# EAGLE schematic Teensy LC meter (EAGLE 8.0.1)
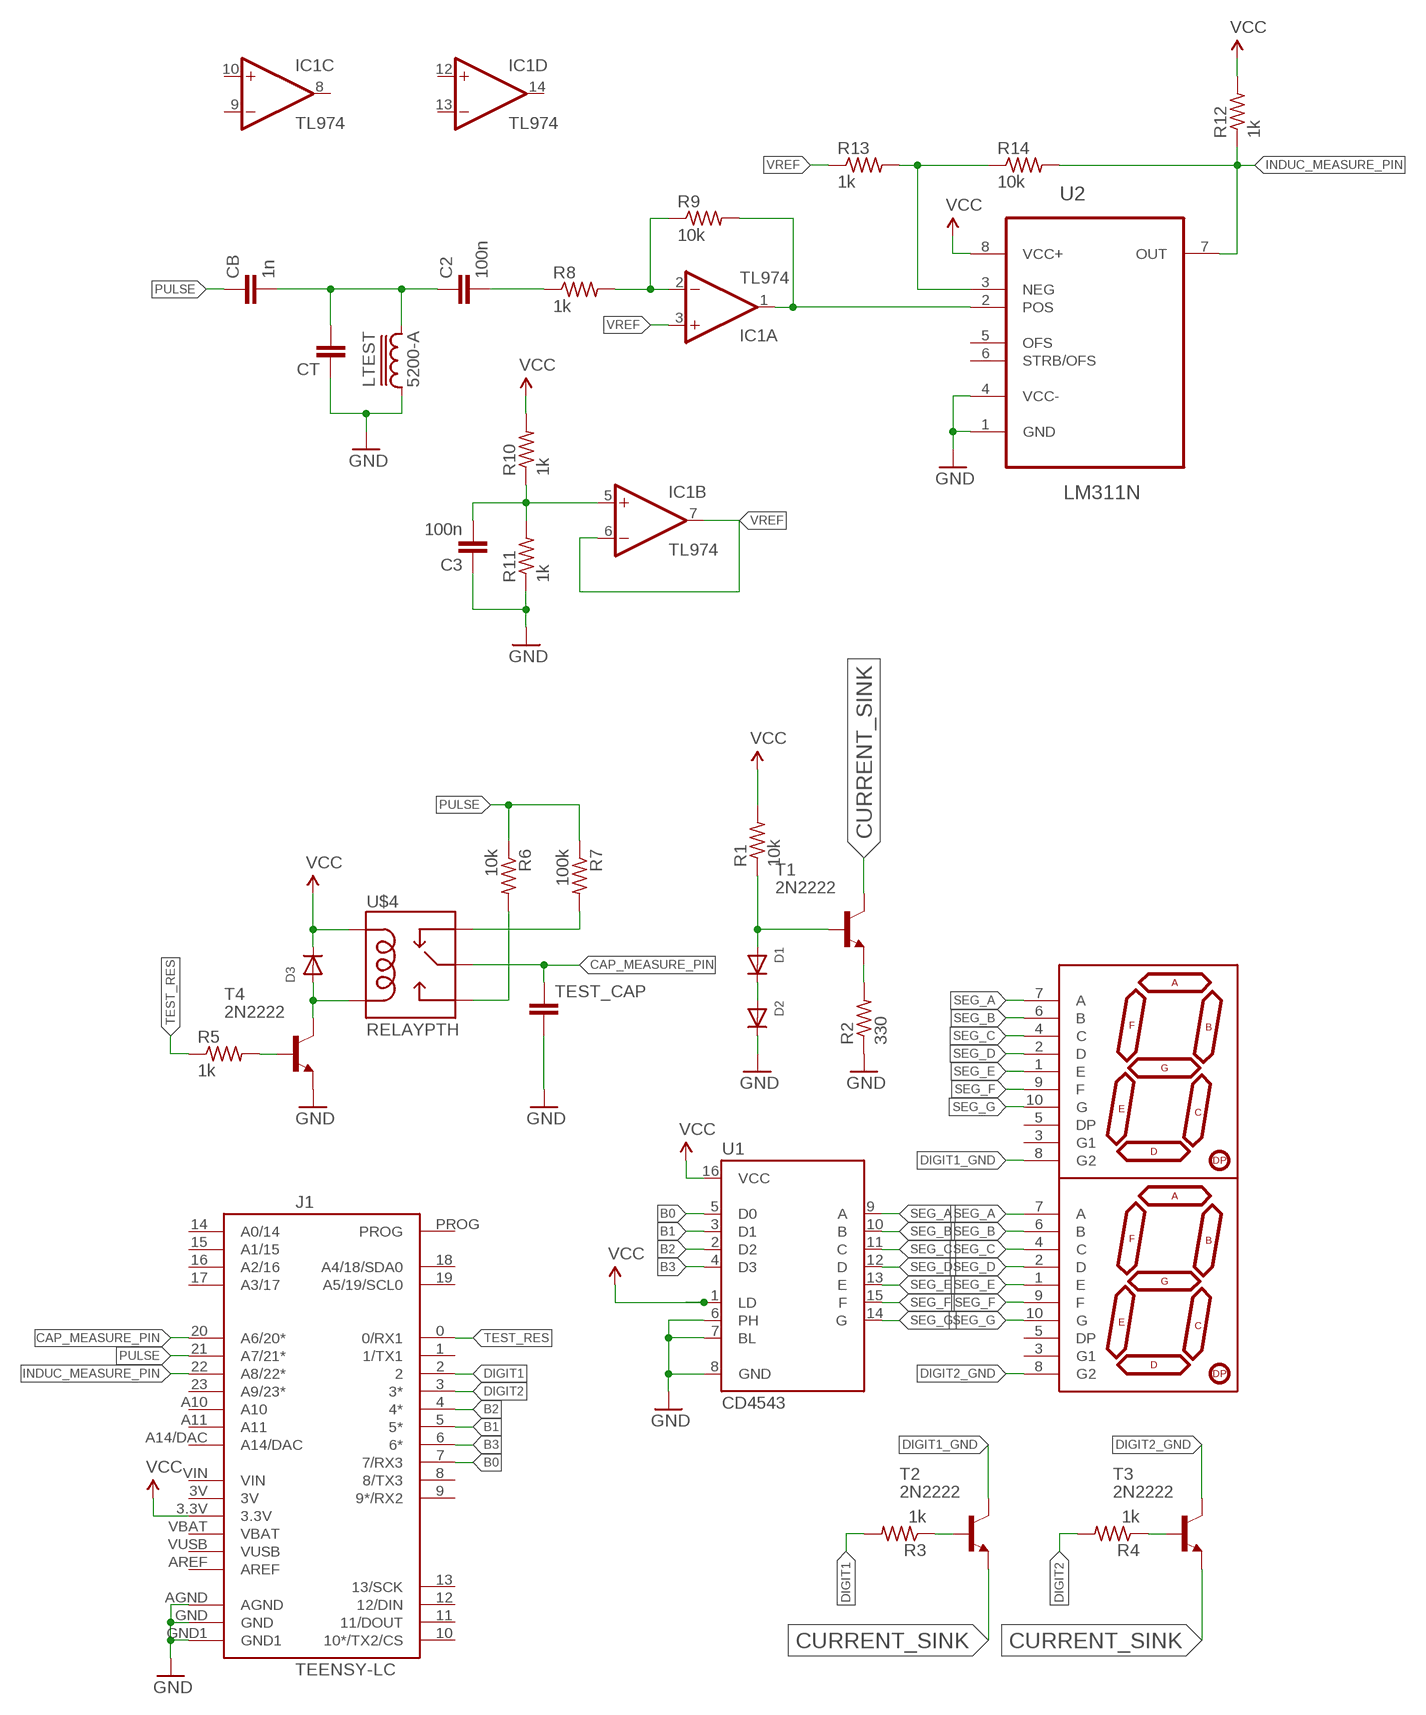
[diagram p0: schematic, sheet 1]

## Parts
C2  100n  CAPPTH  [CAP-PTH-SMALL]
C3  100n  CAPPTH  [CAP-PTH-SMALL]
CB  1n  CAPPTH  [CAP-PTH-SMALL]
CT  CAPPTH  [CAP-PTH-SMALL]
D1  DIODEDO-1N4148  [DO-1N4148]
D2  DIODEDO-1N4148  [DO-1N4148]
D3  DIODEDO-1N4148  [DO-1N4148]
IC1  TL974  QUAD_OPAMPD  [SO14]
J1  TEENSY-LC  TEENSY-3.1NOSILK  [TEENSY-3.1_NOSILK]
LTEST  5200-A  [5200-A]
R1  10k  FLIPFLOP-RES  [0805-THM]
R2  330  FLIPFLOP-RES  [0805-THM]
R3  1k  FLIPFLOP-RES  [0805-THM]
R4  1k  FLIPFLOP-RES  [0805-THM]
R5  1k  FLIPFLOP-RES  [0805-THM]
R6  10k  FLIPFLOP-RES  [0805-THM]
R7  100k  FLIPFLOP-RES  [0805-THM]
R8  1k  FLIPFLOP-RES  [0805-THM]
R9  10k  FLIPFLOP-RES  [0805-THM]
R10  1k  FLIPFLOP-RES  [0805-THM]
R11  1k  FLIPFLOP-RES  [0805-THM]
R12  1k  FLIPFLOP-RES  [0805-THM]
R13  1k  FLIPFLOP-RES  [0805-THM]
R14  10k  FLIPFLOP-RES  [0805-THM]
T1  2N2222  [TO92-EBC-OVAL]
T2  2N2222  [TO92-EBC-OVAL]
T3  2N2222  [TO92-EBC-OVAL]
T4  2N2222  [TO92-EBC-OVAL]
TEST_CAP  CAPPTH  [CAP-PTH-SMALL]
U1  CD4543  HEF4543PTH  [DIL16]
U2  LM311N  [DIP254P762X480-8]
U$2  7-SEGMENT-DISPLAY-1"-REDEZ  [7-SEGMENT-1"PTH-EZ]
U$3  7-SEGMENT-DISPLAY-1"-REDEZ  [7-SEGMENT-1"PTH-EZ]
U$4  RELAYPTH  [RELAY-G5Q]

## Nets
B0: J1.7(7/RX3) U1.5(D0)
B1: J1.5(5*) U1.3(D1)
B2: J1.4(4*) U1.2(D2)
B3: J1.6(6*) U1.4(D3)
CAP_MEASURE_PIN: J1.20(A6/20*) TEST_CAP.1 U$4.2(MAIN)
CURRENT_SINK: T1.C T2.E T3.E
DIGIT1: J1.2 R3.2
DIGIT1_GND: T2.C U$2.8(G2)
DIGIT2: J1.3(3*) R4.2
DIGIT2_GND: T3.C U$3.8(G2)
GND: C3.1 CT.1 D2.C J1.AGND J1.GND J1.GND1 LTEST.1 R2.1 R11.1 T4.E TEST_CAP.2 U1.6(PH) U1.7(BL) U1.8(GND) U2.1(GND) U2.4(VCC-)
INDUC_MEASURE_PIN: J1.22(A8/22*) R12.1 R14.2 U2.7(OUT)
N$1: D1.A R1.1 T1.B
N$2: D1.C D2.A
N$3: R2.2 T1.E
N$4: IC1.2(A:-IN) R8.2 R9.1
N$5: D3.A T4.C U$4.1(COIL2)
N$6: R6.2 U$4.3(NO)
N$7: R4.1 T3.B
N$8: R3.1 T2.B
N$9: R7.2 U$4.4(NC)
N$10: R5.2 T4.B
N$11: IC1.1(A:OUT) R9.2 U2.2(POS)
N$12: C2.2 R8.1
N$13: C2.1 CB.2 CT.2 LTEST.2
N$14: C3.2 IC1.5(B:+IN) R10.1 R11.2
N$17: R13.2 R14.1 U2.3(NEG)
PULSE: CB.1 J1.21(A7/21*) R6.1 R7.1
SEG_A: U1.9(A) U$2.7(A) U$3.7(A)
SEG_B: U1.10(B) U$2.6(B) U$3.6(B)
SEG_C: U1.11(C) U$2.4(C) U$3.4(C)
SEG_D: U1.12(D) U$2.2(D) U$3.2(D)
SEG_E: U1.13(E) U$2.1(E) U$3.1(E)
SEG_F: U1.15(F) U$2.9(F) U$3.9(F)
SEG_G: U1.14(G) U$2.10(G) U$3.10(G)
TEST_RES: J1.0(0/RX1) R5.1
VCC: D3.C J1.3.3V R1.2 R10.2 R12.2 U1.1(LD) U1.16(VCC) U2.8(VCC+) U$4.5(COIL1)
VREF: IC1.3(A:+IN) IC1.6(B:-IN) IC1.7(B:OUT) R13.1
Unconnected: IC1.8(C:OUT) IC1.9(C:-IN) IC1.10(C:+IN) IC1.12(D:+IN) IC1.13(D:-IN) IC1.14(D:OUT) J1.1(1/TX1) J1.3V J1.8(8/TX3) J1.9(9*/RX2) J1.10(10*/TX2/CS) J1.11(11/DOUT) J1.12(12/DIN) J1.13(13/SCK) J1.14(A0/14) J1.15(A1/15) J1.16(A2/16) J1.17(A3/17) J1.18(A4/18/SDA0) J1.19(A5/19/SCL0) J1.23(A9/23*) J1.A10 J1.A11 J1.A14/DAC J1.AREF J1.PROG J1.VBAT J1.VIN J1.VUSB U2.5(OFS) U2.6(STRB/OFS) U$2.3(G1) U$2.5(DP) U$3.3(G1) U$3.5(DP)

## Power pins joined to a net without a drawn wire
V+: IC1.4(P:V+)
V-: IC1.11(P:V-)

## Library data of the parts
C2 C3 CB CT TEST_CAP = SparkFun-Capacitors:CAP: Capacitor Standard 0603 ceramic capacitor, and 0.1" leaded capacitor.
D1-D3 = adafruit:DIODE: Diode SMADIODE - SMA Surface Mount Package 20V 1A Schottky Diode Digikey: 641-1014-6-ND DO-1N4148 - Through Hole Small Current Diode SOD-123 20V 1 A (.5mV Vf) Schottky Diode - Digikey: MBRX120TPMSCT-ND SOD-323 10V 570mA (.38mV Vf, 3ns) Schottky Diode - Digikey: ZLLS410CT-ND SOD-523 30V 30mA Schottky Diode (RB751S-40TE61) - Digikey: RB751S-40TE61CT-ND SOT23-R/W - SOT23 Package (R = Solder Paste/Reflow Ovens, W = Hand-Soldering) BAT54Film 40V 300mA - Digikey: 497-7162-1-ND
IC1 = adafruit:QUAD_OPAMP: OP AMP Standard quad package
J1 = SparkFun-Boards:TEENSY-3.1; SF_ID: DEV-12646
LTEST = Bounrs-Ind:5200-A: HASH INDUCTOR
R1-R14 = adafruit:FLIPFLOP-RES: Flip Flop resistor An 0805 resistor inside a standard 1/4W 5% resistor. Makes for easy mods
T1-T4 = adafruit:2N2222: NPN TRANSISTOR Big oval pads
U1 = SparkFun-DigitalIC:HEF4543: BCD to 7-seg decoder/driver
U2 = ST Microelctronics_By_element14_Batch_1:LM311N: Voltage comparator with strobe; MPN: LM311N; OC_FARNELL: 9487220; OC_NEWARK: 89K0675; PACKAGE: DIP-8; SUPPLIER: STMICROELECTRONICS
U$2 U$3 = SparkFun-Displays:7-SEGMENT-DISPLAY-1"-RED: 7-Segment Display 1" Red (COM-08546) EZ is for kits. Pads are only exposed on the bottom side to help prevent soldering in upside down.
U$4 = SparkFun-Electromechanical:RELAY: SPDT relay (COM-00101)